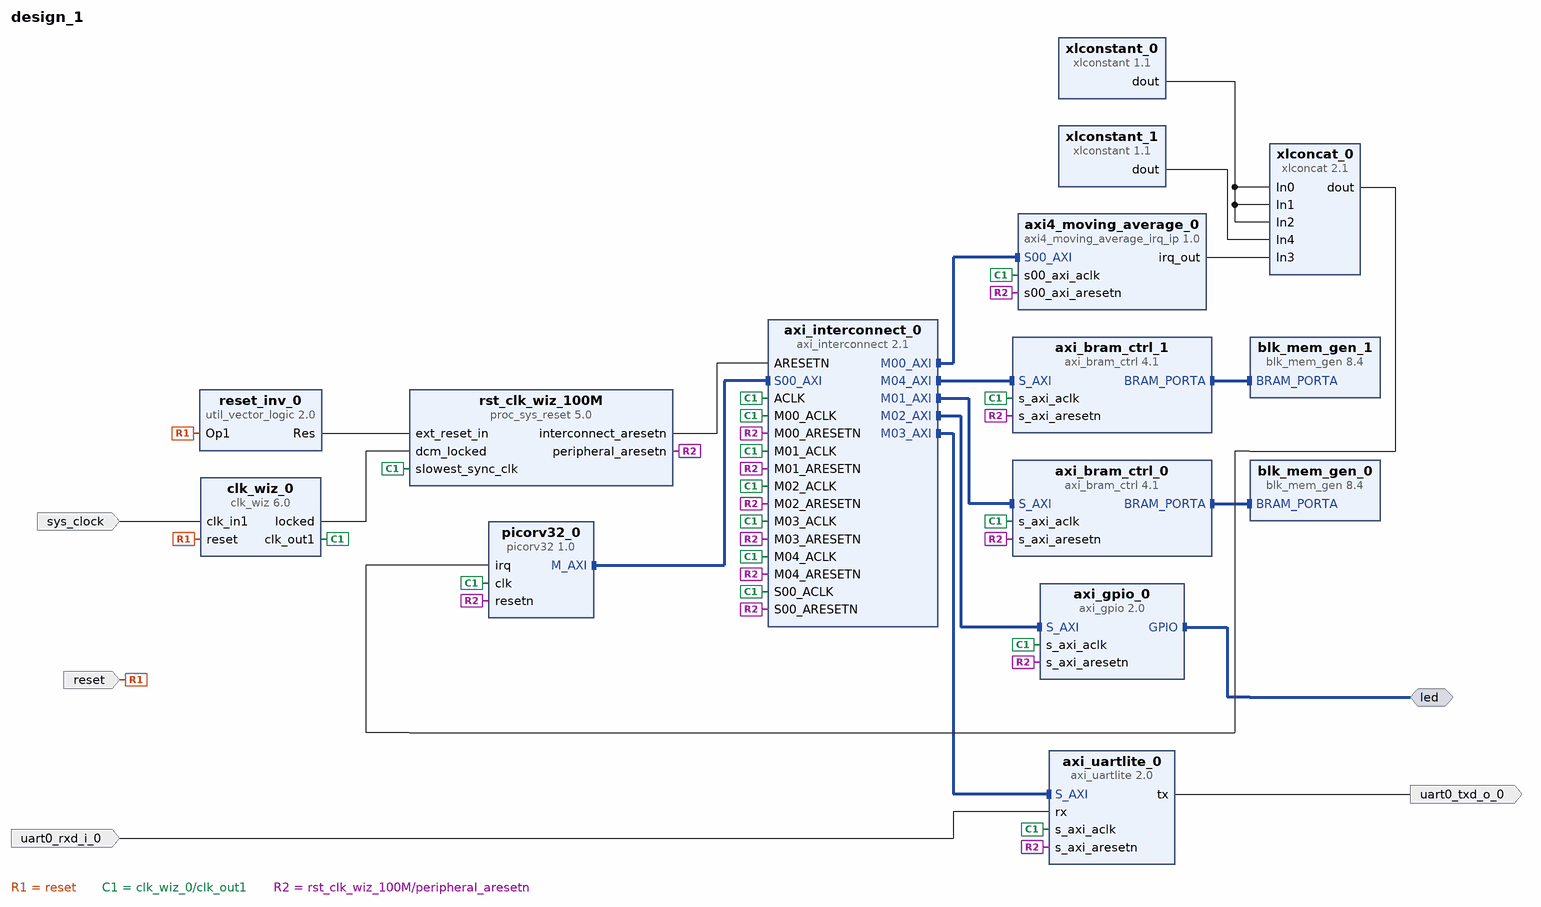
[diagram p0: block diagram of the top level]
# Vivado block design design_1, xc7a100tcsg324-1, Vivado 2019.2
create_bd_design design_1

create_bd_intf_port -mode Master -vlnv xilinx.com:interface:gpio_rtl:1.0 led
create_bd_port -dir I -type clk sys_clock
set_property -dict {CONFIG.FREQ_HZ 100000000 CONFIG.PHASE 0.000} [get_bd_ports sys_clock]
create_bd_port -dir I -type rst reset
set_property -dict {CONFIG.POLARITY ACTIVE_HIGH} [get_bd_ports reset]
create_bd_port -dir O uart0_txd_o_0
create_bd_port -dir I uart0_rxd_i_0

create_bd_cell -type ip -vlnv xilinx.com:ip:axi_bram_ctrl:4.1 axi_bram_ctrl_0
set_property -dict {CONFIG.PROTOCOL AXI4LITE CONFIG.SINGLE_PORT_BRAM 1} [get_bd_cells axi_bram_ctrl_0]
create_bd_cell -type ip -vlnv xilinx.com:ip:axi_bram_ctrl:4.1 axi_bram_ctrl_1
set_property -dict {CONFIG.PROTOCOL AXI4LITE CONFIG.SINGLE_PORT_BRAM 1} [get_bd_cells axi_bram_ctrl_1]
create_bd_cell -type ip -vlnv xilinx.com:ip:axi_gpio:2.0 axi_gpio_0
set_property -dict {CONFIG.GPIO_BOARD_INTERFACE led_16bits CONFIG.USE_BOARD_FLOW true} [get_bd_cells axi_gpio_0]
create_bd_cell -type ip -vlnv xilinx.com:ip:axi_interconnect:2.1 axi_interconnect_0
set_property -dict {CONFIG.NUM_MI 5} [get_bd_cells axi_interconnect_0]
create_bd_cell -type ip -vlnv xilinx.com:ip:axi_uartlite:2.0 axi_uartlite_0
set_property -dict [list \
  CONFIG.C_BAUDRATE 19200 \
  CONFIG.UARTLITE_BOARD_INTERFACE Custom \
  CONFIG.USE_BOARD_FLOW true \
] [get_bd_cells axi_uartlite_0]
create_bd_cell -type ip -vlnv xilinx.com:ip:blk_mem_gen:8.4 blk_mem_gen_0
set_property -dict [list \
  CONFIG.EN_SAFETY_CKT true \
  CONFIG.Enable_32bit_Address true \
  CONFIG.Memory_Type Single_Port_RAM \
  CONFIG.Port_B_Clock 0 \
  CONFIG.Port_B_Enable_Rate 0 \
  CONFIG.Port_B_Write_Rate 0 \
  CONFIG.Register_PortA_Output_of_Memory_Primitives false \
  CONFIG.Use_RSTA_Pin true \
  CONFIG.use_bram_block BRAM_Controller \
] [get_bd_cells blk_mem_gen_0]
create_bd_cell -type ip -vlnv xilinx.com:ip:blk_mem_gen:8.4 blk_mem_gen_1
set_property -dict [list \
  CONFIG.Coe_File ../../../../../../../firmware_irq/firmware.coe \
  CONFIG.Load_Init_File true \
  CONFIG.Memory_Type Single_Port_ROM \
  CONFIG.Port_A_Write_Rate 0 \
] [get_bd_cells blk_mem_gen_1]
create_bd_cell -type ip -vlnv xilinx.com:ip:clk_wiz:6.0 clk_wiz_0
set_property -dict {CONFIG.CLK_IN1_BOARD_INTERFACE sys_clock CONFIG.RESET_BOARD_INTERFACE reset} [get_bd_cells clk_wiz_0]
create_bd_cell -type ip -vlnv clifford.at:user:picorv32:1.0 picorv32_0
set_property -dict {CONFIG.ENABLE_DIV true CONFIG.ENABLE_IRQ true CONFIG.ENABLE_MUL true} [get_bd_cells picorv32_0]
create_bd_cell -type ip -vlnv xilinx.com:ip:proc_sys_reset:5.0 rst_clk_wiz_100M
set_property -dict {CONFIG.RESET_BOARD_INTERFACE Custom CONFIG.USE_BOARD_FLOW true} [get_bd_cells rst_clk_wiz_100M]
create_bd_cell -type ip -vlnv xilinx.com:ip:util_vector_logic:2.0 reset_inv_0
set_property -dict {CONFIG.C_OPERATION not CONFIG.C_SIZE 1} [get_bd_cells reset_inv_0]
create_bd_cell -type ip -vlnv xilinx.com:user:axi4_moving_average_irq_ip:1.0 axi4_moving_average_0
create_bd_cell -type ip -vlnv xilinx.com:ip:xlconcat:2.1 xlconcat_0
set_property -dict [list \
  CONFIG.IN0_WIDTH 1 \
  CONFIG.IN1_WIDTH 1 \
  CONFIG.IN2_WIDTH 1 \
  CONFIG.IN3_WIDTH 1 \
  CONFIG.IN4_WIDTH 28 \
  CONFIG.NUM_PORTS 5 \
] [get_bd_cells xlconcat_0]
create_bd_cell -type ip -vlnv xilinx.com:ip:xlconstant:1.1 xlconstant_0
set_property -dict {CONFIG.CONST_VAL 0} [get_bd_cells xlconstant_0]
create_bd_cell -type ip -vlnv xilinx.com:ip:xlconstant:1.1 xlconstant_1
set_property -dict {CONFIG.CONST_VAL 0 CONFIG.CONST_WIDTH 28} [get_bd_cells xlconstant_1]

# ---- connections ----

connect_bd_intf_net [get_bd_intf_pins axi_interconnect_0/M01_AXI] [get_bd_intf_pins axi_bram_ctrl_0/S_AXI]
connect_bd_intf_net [get_bd_intf_pins axi_bram_ctrl_0/BRAM_PORTA] [get_bd_intf_pins blk_mem_gen_0/BRAM_PORTA]
connect_bd_intf_net [get_bd_intf_pins axi_interconnect_0/M02_AXI] [get_bd_intf_pins axi_gpio_0/S_AXI]
connect_bd_intf_net [get_bd_intf_pins axi_bram_ctrl_1/BRAM_PORTA] [get_bd_intf_pins blk_mem_gen_1/BRAM_PORTA]
connect_bd_intf_net [get_bd_intf_pins axi_interconnect_0/M04_AXI] [get_bd_intf_pins axi_bram_ctrl_1/S_AXI]
connect_bd_intf_net [get_bd_intf_pins picorv32_0/M_AXI] [get_bd_intf_pins axi_interconnect_0/S00_AXI]
connect_bd_intf_net [get_bd_intf_pins axi_interconnect_0/M03_AXI] [get_bd_intf_pins axi_uartlite_0/S_AXI]
connect_bd_intf_net [get_bd_intf_pins axi_interconnect_0/M00_AXI] [get_bd_intf_pins axi4_moving_average_0/S00_AXI]
connect_bd_intf_net [get_bd_intf_ports led] [get_bd_intf_pins axi_gpio_0/GPIO]
connect_bd_net -net util_vector_logic_0_Res [get_bd_pins reset_inv_0/Res] [get_bd_pins rst_clk_wiz_100M/ext_reset_in]
connect_bd_net [get_bd_ports sys_clock] [get_bd_pins clk_wiz_0/clk_in1]
connect_bd_net [get_bd_ports reset] [get_bd_pins clk_wiz_0/reset] [get_bd_pins reset_inv_0/Op1]
connect_bd_net [get_bd_pins clk_wiz_0/locked] [get_bd_pins rst_clk_wiz_100M/dcm_locked]
connect_bd_net [get_bd_pins axi_uartlite_0/tx] [get_bd_ports uart0_txd_o_0]
connect_bd_net -net uart0_rxd_i_0_1 [get_bd_ports uart0_rxd_i_0] [get_bd_pins axi_uartlite_0/rx]
connect_bd_net [get_bd_pins rst_clk_wiz_100M/interconnect_aresetn] [get_bd_pins axi_interconnect_0/ARESETN]
connect_bd_net [get_bd_pins clk_wiz_0/clk_out1] \
  [get_bd_pins axi_bram_ctrl_0/s_axi_aclk] [get_bd_pins axi_bram_ctrl_1/s_axi_aclk] [get_bd_pins axi_gpio_0/s_axi_aclk] \
  [get_bd_pins axi_interconnect_0/ACLK] [get_bd_pins axi_interconnect_0/S00_ACLK] [get_bd_pins axi_interconnect_0/M00_ACLK] \
  [get_bd_pins axi_interconnect_0/M01_ACLK] [get_bd_pins axi_interconnect_0/M02_ACLK] \
  [get_bd_pins axi_interconnect_0/M03_ACLK] [get_bd_pins axi_interconnect_0/M04_ACLK] [get_bd_pins axi_uartlite_0/s_axi_aclk] \
  [get_bd_pins picorv32_0/clk] [get_bd_pins rst_clk_wiz_100M/slowest_sync_clk] \
  [get_bd_pins axi4_moving_average_0/s00_axi_aclk]
connect_bd_net [get_bd_pins rst_clk_wiz_100M/peripheral_aresetn] \
  [get_bd_pins axi_bram_ctrl_0/s_axi_aresetn] [get_bd_pins axi_bram_ctrl_1/s_axi_aresetn] \
  [get_bd_pins axi_gpio_0/s_axi_aresetn] [get_bd_pins axi_interconnect_0/S00_ARESETN] \
  [get_bd_pins axi_interconnect_0/M00_ARESETN] [get_bd_pins axi_interconnect_0/M01_ARESETN] \
  [get_bd_pins axi_interconnect_0/M02_ARESETN] [get_bd_pins axi_interconnect_0/M03_ARESETN] \
  [get_bd_pins axi_interconnect_0/M04_ARESETN] [get_bd_pins axi_uartlite_0/s_axi_aresetn] [get_bd_pins picorv32_0/resetn] \
  [get_bd_pins axi4_moving_average_0/s00_axi_aresetn]
connect_bd_net [get_bd_pins xlconcat_0/dout] [get_bd_pins picorv32_0/irq]
connect_bd_net [get_bd_pins xlconstant_0/dout] [get_bd_pins xlconcat_0/In0] [get_bd_pins xlconcat_0/In1] [get_bd_pins xlconcat_0/In2]
connect_bd_net [get_bd_pins xlconstant_1/dout] [get_bd_pins xlconcat_0/In4]
connect_bd_net [get_bd_pins axi4_moving_average_0/irq_out] [get_bd_pins xlconcat_0/In3]

# ---- address map ----
assign_bd_address -offset 0x00000000 -range 16K -target_address_space [get_bd_addr_spaces picorv32_0/mem_axi] [get_bd_addr_segs axi_bram_ctrl_1/S_AXI/Mem0]
assign_bd_address -offset 0x40000000 -range 64K -target_address_space [get_bd_addr_spaces picorv32_0/mem_axi] [get_bd_addr_segs axi_gpio_0/S_AXI/Reg]
assign_bd_address -offset 0x40600000 -range 64K -target_address_space [get_bd_addr_spaces picorv32_0/mem_axi] [get_bd_addr_segs axi_uartlite_0/S_AXI/Reg]
assign_bd_address -offset 0x44A00000 -range 64K -target_address_space [get_bd_addr_spaces picorv32_0/mem_axi] [get_bd_addr_segs axi4_moving_average_0/S00_AXI/S00_AXI_reg]
assign_bd_address -offset 0xC0000000 -range 8K -target_address_space [get_bd_addr_spaces picorv32_0/mem_axi] [get_bd_addr_segs axi_bram_ctrl_0/S_AXI/Mem0]

validate_bd_design
save_bd_design
